# Altium schematic sheet 100mH common mode choke.schdoc
size 124 x 99 mm
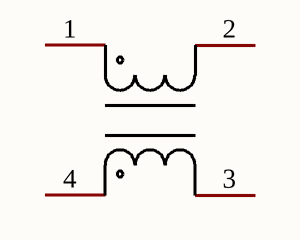
[diagram p0: 100mH common mode choke.schdoc]

## Parts
L?  UU9.8-10mH  [FILTER-TH_4P-L17.0-W12.0-P7.00-D0.6-S8.00]  (value not drawn)

## Nets

Not connected (* = marked no-connect by the designer): L? 1 2 3 4

## Library data of the parts
L? = UU9.8-10mH: Manufacturer: FH(风华); Add into BOM: yes; Number of Lines: 2; Withstanding Voltage: 1kV; Inductance @ Frequency: 10mH@1kHz; DC Resistance (DCR): 800mΩ; Symbol: UU9.8-10MH; Device: UU9.8-10mH; LCSC Part Name: 两路 插件共模滤波器; Supplier Part: C148474; Manufacturer Part: UU9.8-10mH; Supplier Footprint: 插件; JLCPCB Part Class: Extended Part; Datasheet: https://atta.szlcsc.com/upload/public/pdf/source/20210713/C148474_656501625637B4BA0D3972AB204D3908.pdf; Supplier: LCSC; Convert to PCB: yes; Current Rating: -; Voltage Rating - DC: -; Voltage Rating: -; Impedance @ Frequency: -; Operating Temperature: -